# Altium schematic sheet I2C_Breakout.SchDoc
size Letter; Organization: Altium Limited; Address1: L3, 12a Rodborough Rd; Address2: Frenchs Forest; Address3: NSW; Address4: Australia 2086
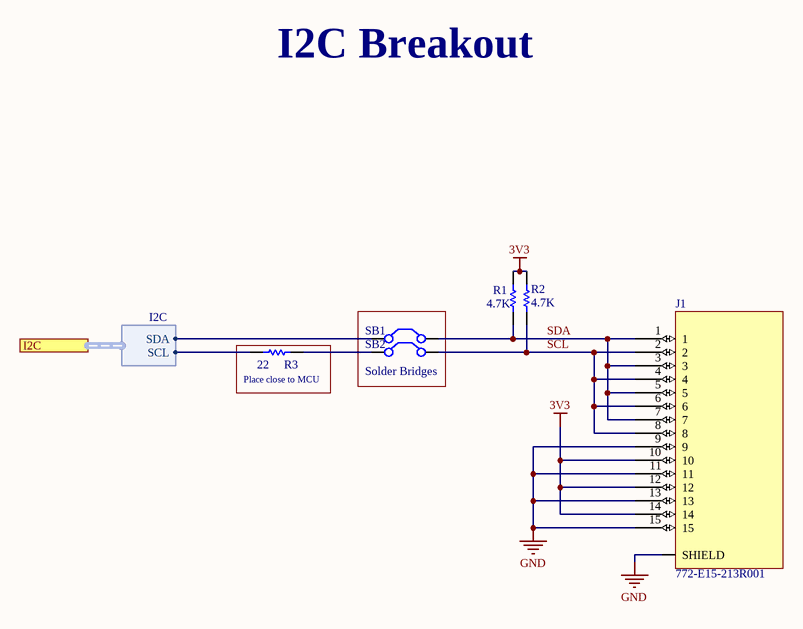
[diagram p0: I2C_Breakout.SchDoc]

## Parts
J1  772-E15-213R001  [15-Pos D-Sub]
R1  value 4.7K  [0402]  (hidden comment: Res1)
R2  value 4.7K  [0402]  (hidden comment: Res1)
R3  value 22  [0402]  (hidden comment: Res1)
SB1  Solder Bridge  [SB-2pos]  (value not drawn)
SB2  Solder Bridge  [SB-2pos]  (value not drawn)

## Blocks framed on the sheet
Place close to MCU: R3
Solder Bridges: SB1 SB2

## Ports
I2C (harness I2C)

## Harnesses
I2C: SDA, SCL

## Nets
3V3: J1.10 J1.12 J1.14 R1.2 R2.2
GND: J1.9 J1.11 J1.13 J1.15 J1.SHIELD
SCL: J1.2 J1.4 J1.6 J1.8 R2.1 SB2.2(C2)
SDA: J1.1 J1.3 J1.5 J1.7 R1.1 SB1.2(C2)
NetR3_1: R3.1 ; port I2C.SCL
NetR3_2: R3.2 SB2.1(C1)
NetSB1_1: SB1.1(C1) ; port I2C.SDA

## Notes on the sheet
- I2C Breakout
- Title
- Size:
- Date:
- Letter
- Number:
- Time:
- Revision:
- Sheet
- of
- File:

## Library data of the parts
J1 = 15-Position Connector: Number of Positions: 15; Connector Type: Receptacle, Female Sockets; Current Rating: 5A; Ingress Protection: IP67 - Dust Tight, Waterproof; Material Flammability Rating: UL94 V-0; Mounting Type: Panel Mount, Through Hole; Operating Temperature: -50°C ~ 100°C; Contact Type: Signal; Shell Material, Finish: Steel, Nickel Plated; Contact Finish: Gold; Manufacturer Part Number: 772-E15-213R001; DigiKey Part Number: NOR1010-ND
R1-R3 = Res1: Resistor
SB1 SB2 = Jumper: Jumper Wire